# EAGLE schematic module (EAGLE 9.6.2)

## Sheet 1 of 4

## Sheet 2 of 4

## Sheet 3 of 4
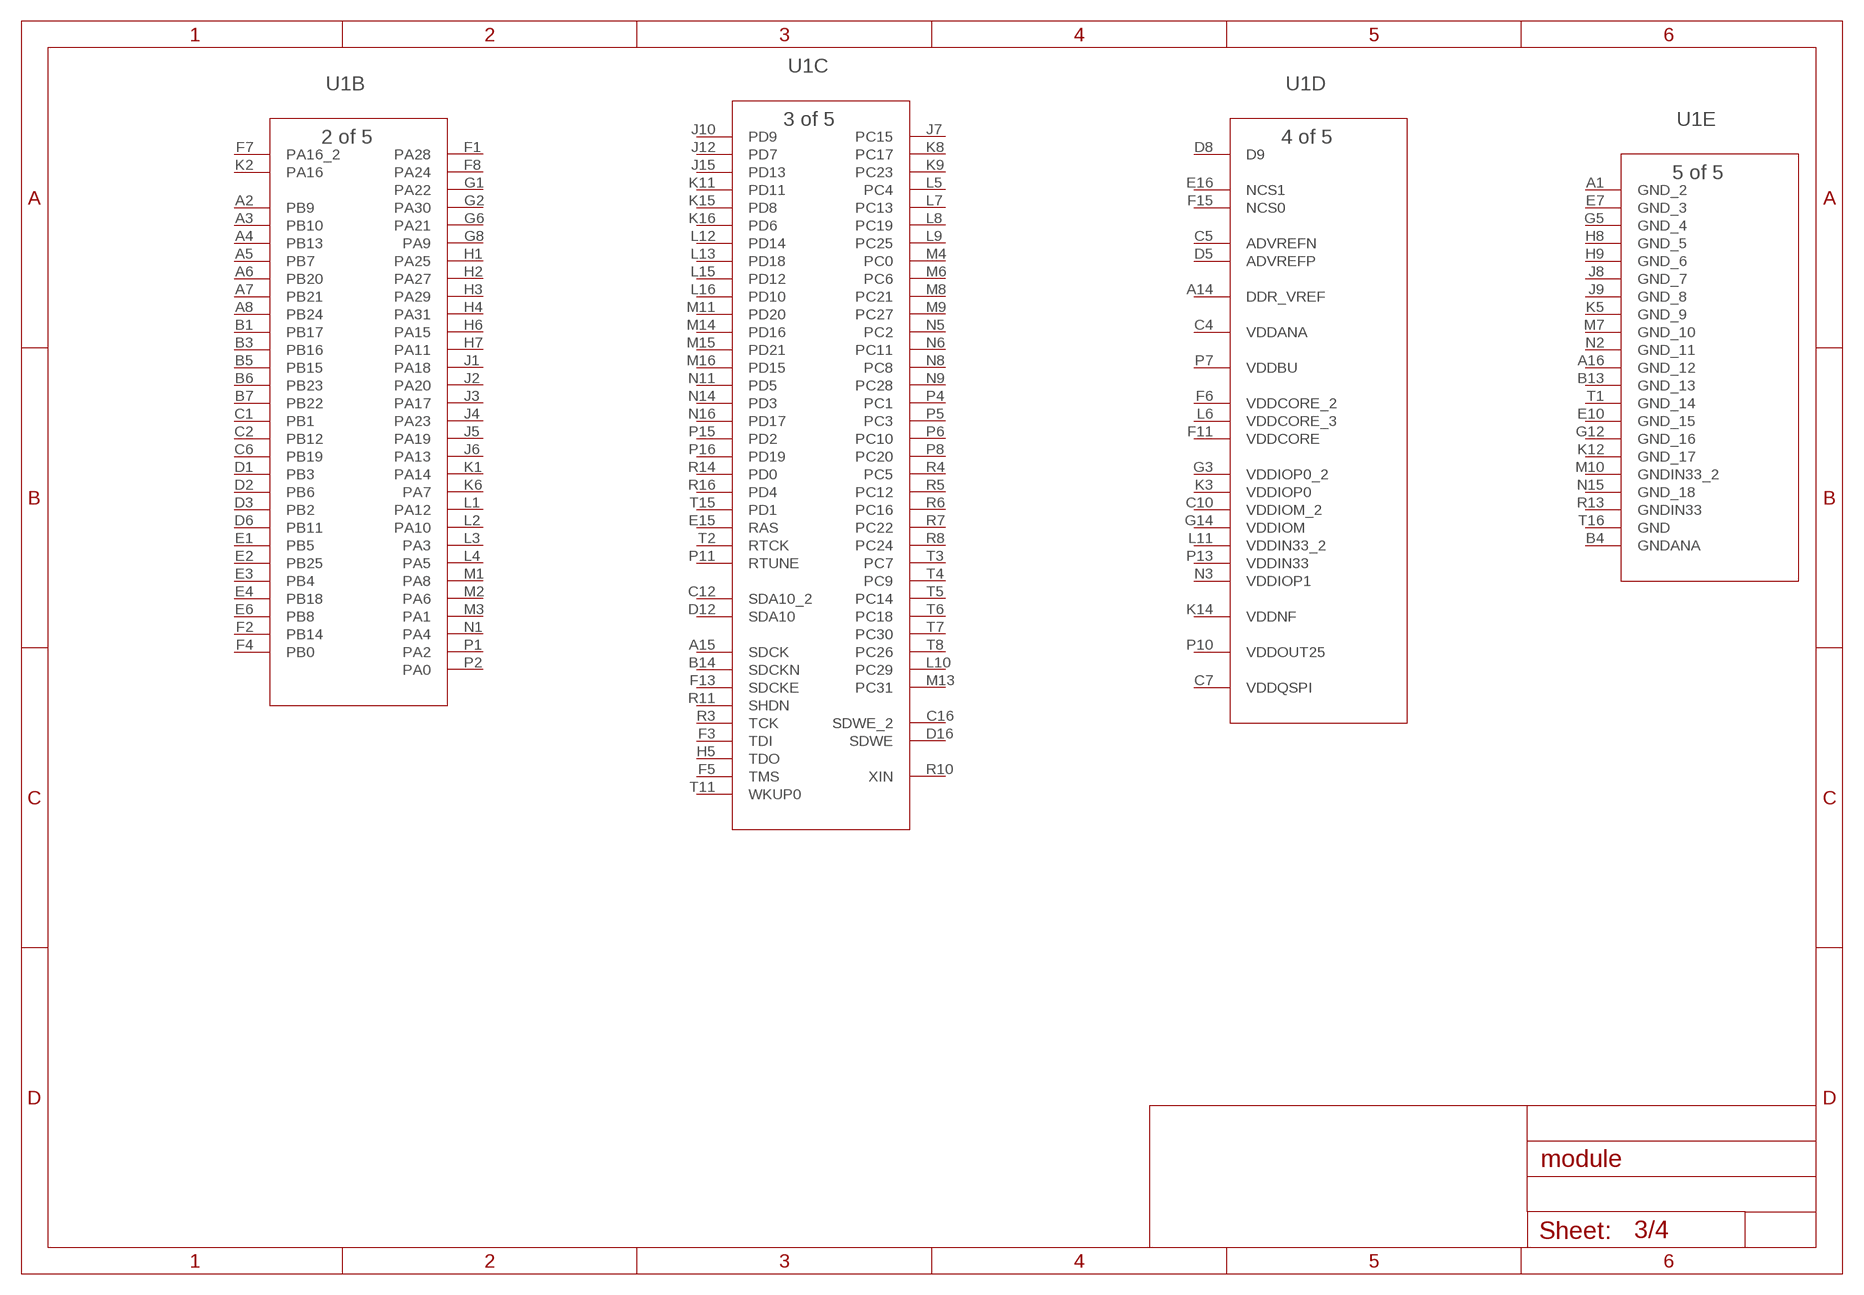
[diagram p0: schematic, sheet 3]

### Parts
U1  SAM9X60-V/DWB  [TFBGA228_DWBB_MCH]
Unconnected: U1.A1(E:GND_2) U1.A2(B:PB9) U1.A3(B:PB10) U1.A4(B:PB13) U1.A5(B:PB7) U1.A6(B:PB20) U1.A7(B:PB21) U1.A8(B:PB24) U1.A15(C:SDCK) U1.A16(E:GND_12) U1.B1(B:PB17) U1.B3(B:PB16) U1.B4(E:GNDANA) U1.B5(B:PB15) U1.B6(B:PB23) U1.B7(B:PB22) U1.B13(E:GND_13) U1.B14(C:SDCKN) U1.C1(B:PB1) U1.C2(B:PB12) U1.C6(B:PB19) U1.C12(C:SDA10_2) U1.C16(C:SDWE_2) U1.D1(B:PB3) U1.D2(B:PB6) U1.D3(B:PB2) U1.D6(B:PB11) U1.D8(D:D9) U1.D12(C:SDA10) U1.D16(C:SDWE) U1.E1(B:PB5) U1.E2(B:PB25) U1.E3(B:PB4) U1.E4(B:PB18) U1.E6(B:PB8) U1.E7(E:GND_3) U1.E10(E:GND_15) U1.E15(C:RAS) U1.E16(D:NCS1) U1.F1(B:PA28) U1.F2(B:PB14) U1.F3(C:TDI) U1.F4(B:PB0) U1.F5(C:TMS) U1.F7(B:PA16_2) U1.F8(B:PA24) U1.F13(C:SDCKE) U1.F15(D:NCS0) U1.G1(B:PA22) U1.G2(B:PA30) U1.G5(E:GND_4) U1.G6(B:PA21) U1.G8(B:PA9) U1.G12(E:GND_16) U1.H1(B:PA25) U1.H2(B:PA27) U1.H3(B:PA29) U1.H4(B:PA31) U1.H5(C:TDO) U1.H6(B:PA15) U1.H7(B:PA11) U1.H8(E:GND_5) U1.H9(E:GND_6) U1.J1(B:PA18) U1.J2(B:PA20) U1.J3(B:PA17) U1.J4(B:PA23) U1.J5(B:PA19) U1.J6(B:PA13) U1.J7(C:PC15) U1.J8(E:GND_7) U1.J9(E:GND_8) U1.J10(C:PD9) U1.J12(C:PD7) U1.J15(C:PD13) U1.K1(B:PA14) U1.K2(B:PA16) U1.K5(E:GND_9) U1.K6(B:PA7) U1.K8(C:PC17) U1.K9(C:PC23) U1.K11(C:PD11) U1.K12(E:GND_17) U1.K15(C:PD8) U1.K16(C:PD6) U1.L1(B:PA12) U1.L2(B:PA10) U1.L3(B:PA3) U1.L4(B:PA5) U1.L5(C:PC4) U1.L7(C:PC13) U1.L8(C:PC19) U1.L9(C:PC25) U1.L10(C:PC29) U1.L11(D:VDDIN33_2) U1.L12(C:PD14) U1.L13(C:PD18) U1.L15(C:PD12) U1.L16(C:PD10) U1.M1(B:PA8) U1.M2(B:PA6) U1.M3(B:PA1) U1.M4(C:PC0) U1.M6(C:PC6) U1.M7(E:GND_10) U1.M8(C:PC21) U1.M9(C:PC27) U1.M10(E:GNDIN33_2) U1.M11(C:PD20) U1.M13(C:PC31) U1.M14(C:PD16) U1.M15(C:PD21) U1.M16(C:PD15) U1.N1(B:PA4) U1.N2(E:GND_11) U1.N5(C:PC2) U1.N6(C:PC11) U1.N8(C:PC8) U1.N9(C:PC28) U1.N11(C:PD5) U1.N14(C:PD3) U1.N15(E:GND_18) U1.N16(C:PD17) U1.P1(B:PA2) U1.P2(B:PA0) U1.P4(C:PC1) U1.P5(C:PC3) U1.P6(C:PC10) U1.P8(C:PC20) U1.P10(D:VDDOUT25) U1.P11(C:RTUNE) U1.P13(D:VDDIN33) U1.P15(C:PD2) U1.P16(C:PD19) U1.R3(C:TCK) U1.R4(C:PC5) U1.R5(C:PC12) U1.R6(C:PC16) U1.R7(C:PC22) U1.R8(C:PC24) U1.R10(C:XIN) U1.R11(C:SHDN) U1.R13(E:GNDIN33) U1.R14(C:PD0) U1.R16(C:PD4) U1.T1(E:GND_14) U1.T2(C:RTCK) U1.T3(C:PC7) U1.T4(C:PC9) U1.T5(C:PC14) U1.T6(C:PC18) U1.T7(C:PC30) U1.T8(C:PC26) U1.T11(C:WKUP0) U1.T15(C:PD1) U1.T16(E:GND)

## Sheet 4 of 4
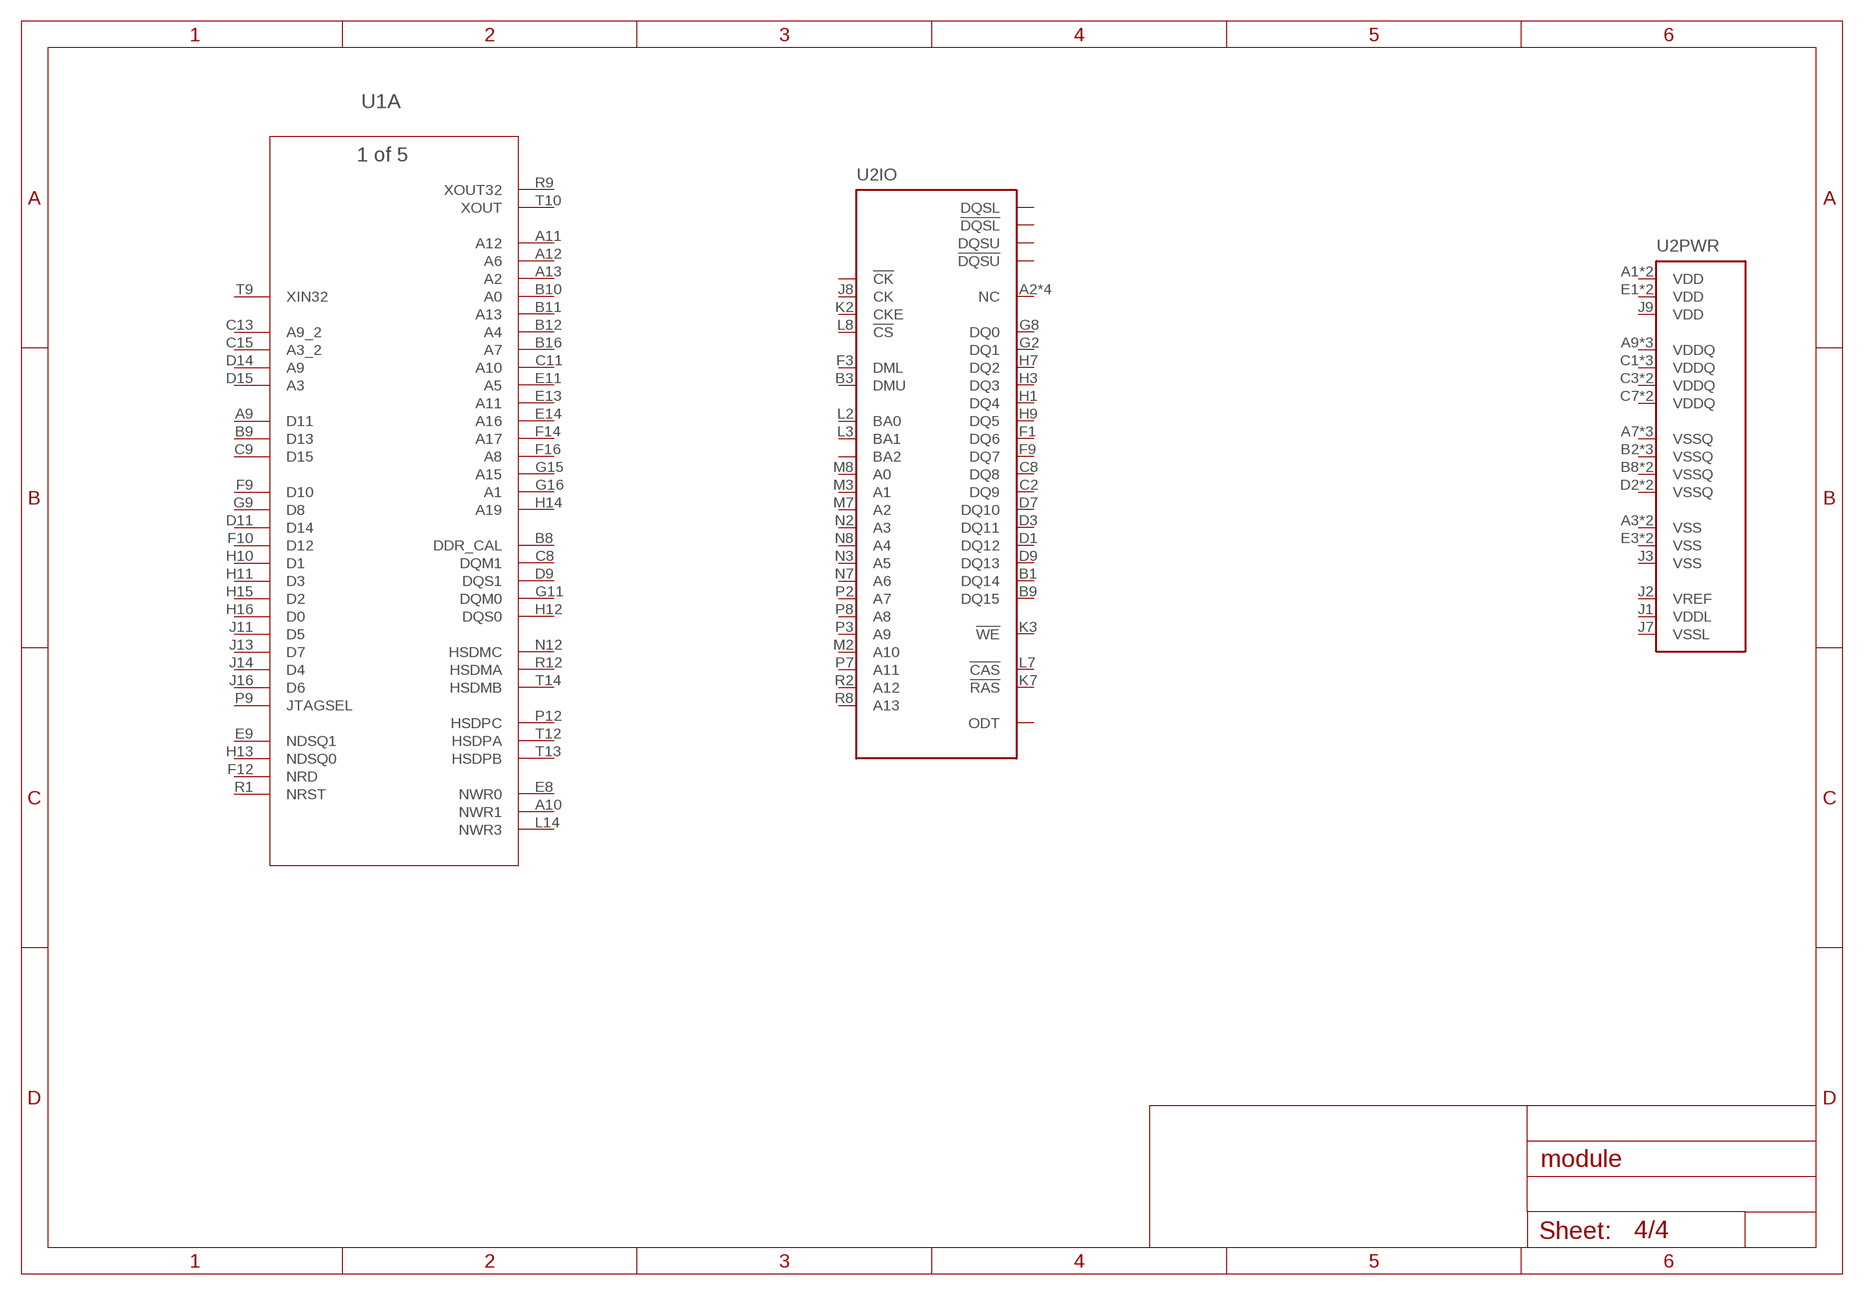
[diagram p1: schematic, sheet 4]

### Parts
U2  W971G  [BGA135C80P9X15_1250X800X120]
Unconnected: U1.A9(A:D11) U1.A10(A:NWR1) U1.A11(A:A12) U1.A12(A:A6) U1.A13(A:A2) U1.B8(A:DDR_CAL) U1.B9(A:D13) U1.B10(A:A0) U1.B11(A:A13) U1.B12(A:A4) U1.B16(A:A7) U1.C8(A:DQM1) U1.C9(A:D15) U1.C11(A:A10) U1.C13(A:A9_2) U1.C15(A:A3_2) U1.D9(A:DQS1) U1.D11(A:D14) U1.D14(A:A9) U1.D15(A:A3) U1.E8(A:NWR0) U1.E9(A:NDSQ1) U1.E11(A:A5) U1.E13(A:A11) U1.E14(A:A16) U1.F9(A:D10) U1.F10(A:D12) U1.F12(A:NRD) U1.F14(A:A17) U1.F16(A:A8) U1.G9(A:D8) U1.G11(A:DQM0) U1.G15(A:A15) U1.G16(A:A1) U1.H10(A:D1) U1.H11(A:D3) U1.H12(A:DQS0) U1.H13(A:NDSQ0) U1.H14(A:A19) U1.H15(A:D2) U1.H16(A:D0) U1.J11(A:D5) U1.J13(A:D7) U1.J14(A:D4) U1.J16(A:D6) U1.L14(A:NWR3) U1.N12(A:HSDMC) U1.P9(A:JTAGSEL) U1.P12(A:HSDPC) U1.R1(A:NRST) U1.R9(A:XOUT32) U1.R12(A:HSDMA) U1.T9(A:XIN32) U1.T10(A:XOUT) U1.T12(A:HSDPA) U1.T13(A:HSDPB) U1.T14(A:HSDMB) U2.A2(IO:NC) U2.A8(IO:!DQSU) U2.B1(IO:DQ14) U2.B3(IO:DMU) U2.B7(IO:DQSU) U2.B9(IO:DQ15) U2.C2(IO:DQ9) U2.C8(IO:DQ8) U2.D1(IO:DQ12) U2.D3(IO:DQ11) U2.D7(IO:DQ10) U2.D9(IO:DQ13) U2.E2(IO:NC) U2.E8(IO:!DQSL) U2.F1(IO:DQ6) U2.F3(IO:DML) U2.F7(IO:DQSL) U2.F9(IO:DQ7) U2.G2(IO:DQ1) U2.G8(IO:DQ0) U2.H1(IO:DQ4) U2.H3(IO:DQ3) U2.H7(IO:DQ2) U2.H9(IO:DQ5) U2.J1(PWR:VDDL) U2.J2(PWR:VREF) U2.J7(PWR:VSSL) U2.J8(IO:CK) U2.K2(IO:CKE) U2.K3(IO:!WE) U2.K7(IO:!RAS) U2.K8(IO:!CK) U2.K9(IO:ODT) U2.L1(IO:BA2) U2.L2(IO:BA0) U2.L3(IO:BA1) U2.L7(IO:!CAS) U2.L8(IO:!CS) U2.M2(IO:A10) U2.M3(IO:A1) U2.M7(IO:A2) U2.M8(IO:A0) U2.N2(IO:A3) U2.N3(IO:A5) U2.N7(IO:A6) U2.N8(IO:A4) U2.P2(IO:A7) U2.P3(IO:A9) U2.P7(IO:A11) U2.P8(IO:A8) U2.R2(IO:A12) U2.R3(IO:NC) U2.R7(IO:NC) U2.R8(IO:A13)

## Power pins joined to a net without a drawn wire
ADVREFN: U1.C5(D:ADVREFN)
ADVREFP: U1.D5(D:ADVREFP)
DDR_VREF: U1.A14(D:DDR_VREF)
VDD: U2.A1(PWR:VDD) U2.E1(PWR:VDD) U2.J9(PWR:VDD) U2.M9(PWR:VDD) U2.R1(PWR:VDD)
VDDANA: U1.C4(D:VDDANA)
VDDBU: U1.P7(D:VDDBU)
VDDCORE: U1.F11(D:VDDCORE)
VDDCORE_2: U1.F6(D:VDDCORE_2)
VDDCORE_3: U1.L6(D:VDDCORE_3)
VDDIOM: U1.G14(D:VDDIOM)
VDDIOM_2: U1.C10(D:VDDIOM_2)
VDDIOP0: U1.K3(D:VDDIOP0)
VDDIOP0_2: U1.G3(D:VDDIOP0_2)
VDDIOP1: U1.N3(D:VDDIOP1)
VDDNF: U1.K14(D:VDDNF)
VDDQ: U2.A9(PWR:VDDQ) U2.C1(PWR:VDDQ) U2.C3(PWR:VDDQ) U2.C7(PWR:VDDQ) U2.C9(PWR:VDDQ) U2.E9(PWR:VDDQ) U2.G1(PWR:VDDQ) U2.G3(PWR:VDDQ) U2.G7(PWR:VDDQ) U2.G9(PWR:VDDQ)
VDDQSPI: U1.C7(D:VDDQSPI)
VSS: U2.A3(PWR:VSS) U2.E3(PWR:VSS) U2.J3(PWR:VSS) U2.N1(PWR:VSS) U2.P9(PWR:VSS)
VSSQ: U2.A7(PWR:VSSQ) U2.B2(PWR:VSSQ) U2.B8(PWR:VSSQ) U2.D2(PWR:VSSQ) U2.D8(PWR:VSSQ) U2.E7(PWR:VSSQ) U2.F2(PWR:VSSQ) U2.F8(PWR:VSSQ) U2.H2(PWR:VSSQ) U2.H8(PWR:VSSQ)

## Library data of the parts
U1 = parts-microchip:SAM9X60-V/DWB; BUILT_BY: EMA_Cory; COPYRIGHT: Copyright (C) 2018 Accelerated Designs. All rights reserved; DATASHEET: https://ww1.microchip.com/downloads/en/DeviceDoc/SAM9X60-Data-Sheet-DS60001579C.pdf; MANUFACTURER_PART_NUMBER: SAM9X60-V/DWB; SOURCELIBRARY: Microchip_2020-09-10; VENDOR: Microchip
U2 = parts-winbond:W971G